# EAGLE design ADE9000_prototipo (EAGLE 9.4.2)
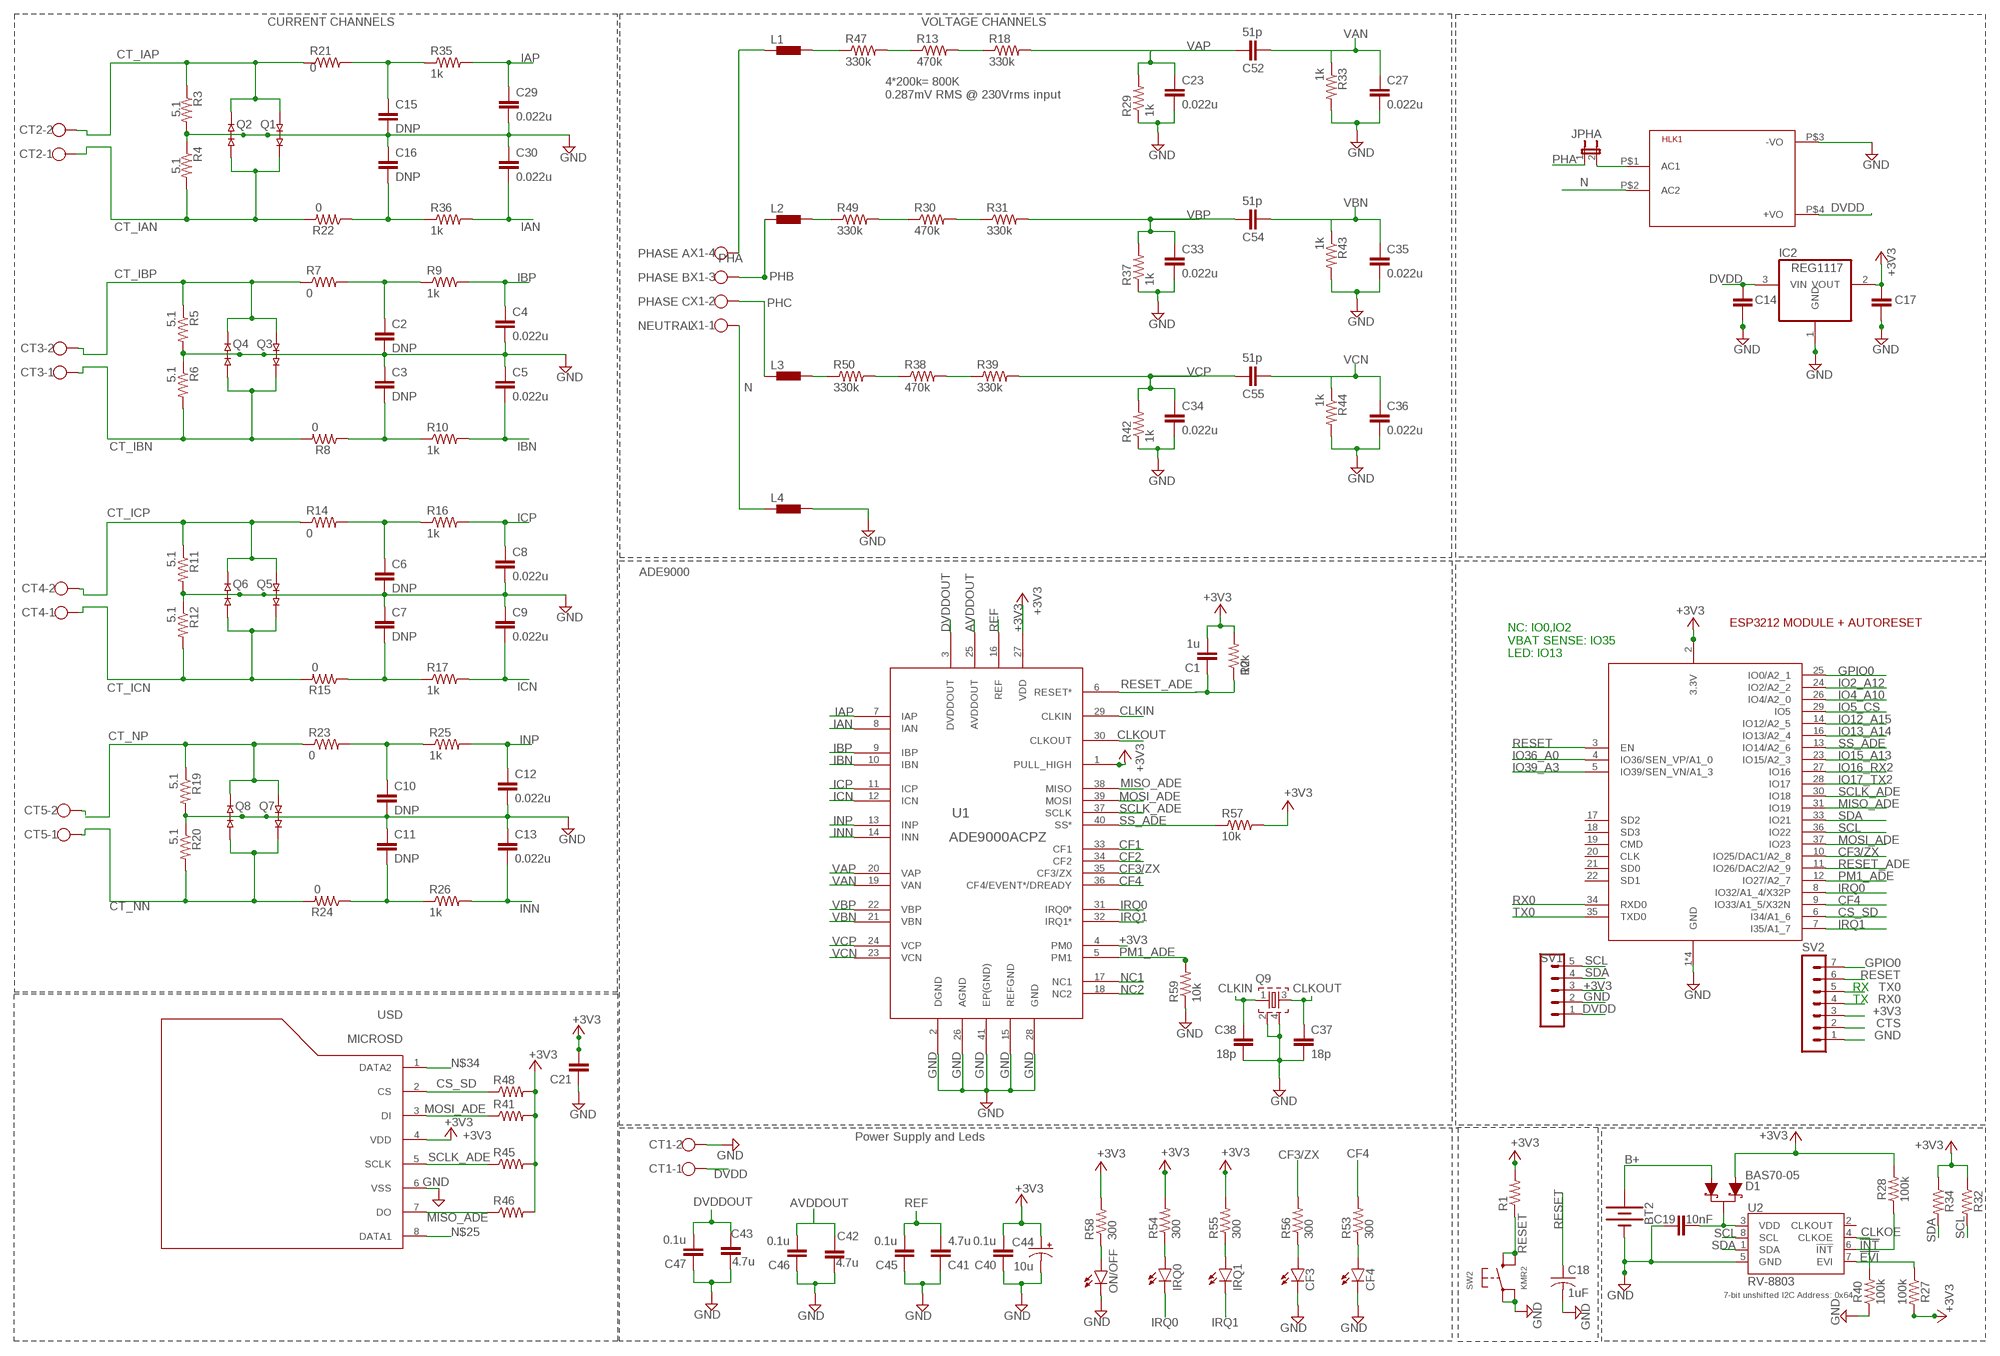
[diagram p0: schematic, sheet 1]

## Parts
BT2  BATTERY-12MM_SMD  [BATTCON_12MM]
C1  1u  C-EUC0805  [C0805]
C2  DNP  C-EUC0805  [C0805]
C3  DNP  C-EUC0805  [C0805]
C4  0.022u  C-EUC0805  [C0805]
C5  0.022u  C-EUC0805  [C0805]
C6  DNP  C-EUC0805  [C0805]
C7  DNP  C-EUC0805  [C0805]
C8  0.022u  C-EUC0805  [C0805]
C9  0.022u  C-EUC0805  [C0805]
C10  DNP  C-EUC0805  [C0805]
C11  DNP  C-EUC0805  [C0805]
C12  0.022u  C-EUC0805  [C0805]
C13  0.022u  C-EUC0805  [C0805]
C14  C-EUC1206  [C1206]
C15  DNP  C-EUC0805  [C0805]
C16  DNP  C-EUC0805  [C0805]
C17  C-EUC1206  [C1206]
C18  1uF  C-USC0805  [C0805]
C19  10nF  10NF-0603-50V-10%  [0603]
C21  0.1u  C-EUC0805  [C0805]
C23  0.022u  C-EUC0805  [C0805]
C27  0.022u  C-EUC0603  [C0603]
C29  0.022u  C-EUC0805  [C0805]
C30  0.022u  C-EUC0805  [C0805]
C33  0.022u  C-EUC0805  [C0805]
C34  0.022u  C-EUC0805  [C0805]
C35  0.022u  C-EUC0603  [C0603]
C36  0.022u  C-EUC0603  [C0603]
C37  18p  C-EUC0805  [C0805]
C38  18p  C-EUC0805  [C0805]
C40  0.1u  C-EUC0805  [C0805]
C41  4.7u  C-EUC0805  [C0805]
C42  4.7u  C-EUC0805  [C0805]
C43  4.7u  C-EUC0805  [C0805]
C44  10u  CPOL-USE1.8-4  [E1,8-4]
C45  0.1u  C-EUC0805  [C0805]
C46  0.1u  C-EUC0805  [C0805]
C47  0.1u  C-EUC0805  [C0805]
C52  51p  C-EUC0603  [C0603]
C54  51p  C-EUC0603  [C0603]
C55  51p  C-EUC0603  [C0603]
CF3  LEDCHIPLED_1206  [CHIPLED_1206]
CF4  LEDCHIPLED_1206  [CHIPLED_1206]
CT1  W237-102  [W237-102]
CT2  W237-102  [W237-102]
CT3  W237-102  [W237-102]
CT4  W237-102  [W237-102]
CT5  W237-102  [W237-102]
D1  BAS70-05  DIODE-SCHOTTKY-DUAL  [SOT23-3]
HLK1  HLK-PM013W  [HLK-PM01]
IC2  REG1117  [SOT223]
IRQ0  LEDCHIPLED_1206  [CHIPLED_1206]
IRQ1  LEDCHIPLED_1206  [CHIPLED_1206]
JPHA  JP1E  [JP1]
L1  1500  FERRITE_BEAD0805  [M0805]
L2  1500  FERRITE_BEAD0805  [M0805]
L3  1500  FERRITE_BEAD0805  [M0805]
L4  1500  FERRITE_BEAD0805  [M0805]
ON/OFF  LEDCHIPLED_1206  [CHIPLED_1206]
Q1  MMBD4148SE  DUAL_DIODE_SOT23-3  [SOT23-3]
Q2  MMBD4148SE  DUAL_DIODE_SOT23-3  [SOT23-3]
Q3  MMBD4148SE  DUAL_DIODE_SOT23-3  [SOT23-3]
Q4  MMBD4148SE  DUAL_DIODE_SOT23-3  [SOT23-3]
Q5  MMBD4148SE  DUAL_DIODE_SOT23-3  [SOT23-3]
Q6  MMBD4148SE  DUAL_DIODE_SOT23-3  [SOT23-3]
Q7  MMBD4148SE  DUAL_DIODE_SOT23-3  [SOT23-3]
Q8  MMBD4148SE  DUAL_DIODE_SOT23-3  [SOT23-3]
Q9  ECS-245.7-12-33Q-JES-TR  CRYSTAL_SMD128  [SMD_4PIN_3.2X2.1]
R1  R-US_R0805  [R0805]
R2  10k  R-US_R0805  [R0805]
R3  5.1  R-US_R0805  [R0805]
R4  5.1  R-US_R0805  [R0805]
R5  5.1  R-US_R0805  [R0805]
R6  5.1  R-US_R0805  [R0805]
R7  0  R-US_R0805  [R0805]
R8  0  R-US_R0805  [R0805]
R9  1k  R-US_R0805  [R0805]
R10  1k  R-US_R0805  [R0805]
R11  5.1  R-US_R0805  [R0805]
R12  5.1  R-US_R0805  [R0805]
R13  470k  R-US_R0805  [R0805]
R14  0  R-US_R0805  [R0805]
R15  0  R-US_R0805  [R0805]
R16  1k  R-US_R0805  [R0805]
R17  1k  R-US_R0805  [R0805]
R18  330k  R-US_R0805  [R0805]
R19  5.1  R-US_R0805  [R0805]
R20  5.1  R-US_R0805  [R0805]
R21  0  R-US_R0805  [R0805]
R22  0  R-US_R0805  [R0805]
R23  0  R-US_R0805  [R0805]
R24  0  R-US_R0805  [R0805]
R25  1k  R-US_R0805  [R0805]
R26  1k  R-US_R0805  [R0805]
R27  100k  100KOHM-0603-1/10W-1%  [0603]
R28  100k  100KOHM-0603-1/10W-1%  [0603]
R29  1k  R-US_R0805  [R0805]
R30  470k  R-US_R0805  [R0805]
R31  330k  R-US_R0805  [R0805]
R32  4.7k  4.7KOHM-0603-1/10W-1%  [0603]
R33  1k  R-US_R0603  [R0603]
R34  4.7KOHM-0603-1/10W-1%  [0603]
R35  1k  R-US_R0805  [R0805]
R36  1k  R-US_R0805  [R0805]
R37  1k  R-US_R0805  [R0805]
R38  470k  R-US_R0805  [R0805]
R39  330k  R-US_R0805  [R0805]
R40  100k  100KOHM-0603-1/10W-1%  [0603]
R41  R-US_R0805  [R0805]
R42  1k  R-US_R0805  [R0805]
R43  1k  R-US_R0603  [R0603]
R44  1k  R-US_R0603  [R0603]
R45  R-US_R0805  [R0805]
R46  R-US_R0805  [R0805]
R47  330k  R-US_R0805  [R0805]
R48  R-US_R0805  [R0805]
R49  330k  R-US_R0805  [R0805]
R50  330k  R-US_R0805  [R0805]
R53  300  R-US_R0805  [R0805]
R54  300  R-US_R0805  [R0805]
R55  300  R-US_R0805  [R0805]
R56  300  R-US_R0805  [R0805]
R57  10k  R-US_R0805  [R0805]
R58  300  R-US_R0805  [R0805]
R59  10k  R-US_R0805  [R0805]
SV1  MA05-1  [MA05-1]
SV2  MA07-1  [MA07-1]
SW2  KMR2  SWITCH_TACT_SMT4.6X2.8  [BTN_KMR2_4.6X2.8]
U1  ADE9000ACPZ  [CP_40_7]
U2  RV-8803  [RV-3028]
USD  MICROSD  [MICROSD]
X1  W237-4  [W237-4]
X4  ESP32_WROOM32_SKINNY  [WROOM32_SKINNY]

## Nets
!EVI: R27.1 U2.7(EVI)
!INT: R28.1 U2.6(!INT)
+3V3: C1.2 C17.1 C21.2 C40.2 C44.+ D1.1(A) IC2.2(VOUT) R1.2 R2.2 R27.2 R28.2 R32.1 R34.1 R41.2 R45.2 R46.2 R48.2 R54.2 R55.2 R57.2 R58.2 SV1.3 SV2.3 U1.1(PULL_HIGH) U1.4(PM0) U1.27(VDD) USD.4(VDD) X4.2(3.3V)
AVDDOUT: C42.1 C46.2 U1.25(AVDDOUT)
B+: BT2.PWR@1(+) D1.2(A1)
CF1: U1.33(CF1)
CF2: U1.34(CF2)
CF3/ZX: R56.2 U1.35(CF3/ZX) X4.10(IO25/DAC1/A2_8)
CF4: R53.2 U1.36(CF4/EVENT*/DREADY) X4.9(IO33/A1_5/X32N)
CLKIN: C38.1 Q9.1 U1.29(CLKIN)
CLKOE: R40.2 U2.4(CLKOE)
CLKOUT: C37.1 Q9.3 U1.30(CLKOUT)
CS_SD: R48.1 USD.2(CS) X4.6(I34/A1_6)
CT_IAN: CT2.1 Q1.2 Q2.1 R4.2 R22.2
CT_IAP: CT2.2 Q1.1 Q2.2 R3.1 R21.1
CT_IBN: CT3.1 Q3.2 Q4.1 R6.2 R8.2
CT_IBP: CT3.2 Q3.1 Q4.2 R5.1 R7.1
CT_ICN: CT4.1 Q5.2 Q6.1 R12.2 R15.2
CT_ICP: CT4.2 Q5.1 Q6.2 R11.1 R14.1
CT_NN: CT5.1 Q7.2 Q8.1 R20.2 R24.2
CT_NP: CT5.2 Q7.1 Q8.2 R19.1 R23.1
CTS: SV2.2
DVDD: C14.1 CT1.1 HLK1.P$4(+VO) IC2.3(VIN) SV1.1
DVDDOUT: C43.1 C47.2 U1.3(DVDDOUT)
GND: BT2.GND(-) C2.2 C3.1 C4.2 C5.1 C6.2 C7.1 C8.2 C9.1 C10.2 C11.1 C12.2 C13.1 C14.2 C15.2 C16.1 C17.2 C18.2 C19.1 C21.1 C23.2 C27.2 C29.2 C30.1 C33.2 C34.2 C35.2 C36.2 C37.2 C38.2 C40.1 C41.1 C42.2 C43.2 C44.- C45.1 C46.1 C47.1 CF3.C CF4.C CT1.2 HLK1.P$3(-VO) IC2.1(GND) L4.2 ON/OFF.C Q1.3 Q2.3 Q3.3 Q4.3 Q5.3 Q6.3 Q7.3 Q8.3 Q9.2 Q9.4 R3.2 R4.1 R5.2 R6.1 R11.2 R12.1 R19.2 R20.1 R29.1 R33.2 R37.1 R40.1 R42.1 R43.2 R44.2 R59.1 SV1.2 SV2.1 SW2.A'(P1) SW2.A(P) U1.2(DGND) U1.15(REFGND) U1.26(AGND) U1.28(GND) U1.41(EP(GND)) U2.5(GND) USD.6(VSS) X4.1(GND) X4.15(GND) X4.38(GND) X4.P$1(GND)
GPIO0: SV2.7 X4.25(IO0/A2_1)
IAN: C30.2 R36.2 U1.8(IAN)
IAP: C29.1 R35.2 U1.7(IAP)
IBN: C5.2 R10.2 U1.10(IBN)
IBP: C4.1 R9.2 U1.9(IBP)
ICN: C9.2 R17.2 U1.12(ICN)
ICP: C8.1 R16.2 U1.11(ICP)
INN: C13.2 R26.2 U1.14(INN)
INP: C12.1 R25.2 U1.13(INP)
IO2_A12: X4.24(IO2/A2_2)
IO4_A10: X4.26(IO4/A2_0)
IO5_CS: X4.29(IO5)
IO12_A15: X4.14(IO12/A2_5)
IO13_A14: X4.16(IO13/A2_4)
IO15_A13: X4.23(IO15/A2_3)
IO16_RX2: X4.27(IO16)
IO17_TX2: X4.28(IO17)
IO36_A0: X4.4(IO36/SEN_VP/A1_0)
IO39_A3: X4.5(IO39/SEN_VN/A1_3)
IRQ0: IRQ0.C U1.31(IRQ0*) X4.8(IO32/A1_4/X32P)
IRQ1: IRQ1.C U1.32(IRQ1*) X4.7(I35/A1_7)
MISO_ADE: R46.1 U1.38(MISO) USD.7(DO) X4.31(IO19)
MOSI_ADE: R41.1 U1.39(MOSI) USD.3(DI) X4.37(IO23)
N: HLK1.P$2(AC2) L4.1 X1.1
N$1: C19.2 D1.3(C) U2.3(VDD)
N$2: R13.1 R47.2
N$4: C3.2 R8.1 R10.1
N$5: C2.1 R7.2 R9.1
N$6: HLK1.P$1(AC1) JPHA.2
N$7: L3.2 R50.1
N$8: L2.2 R49.1
N$10: C7.2 R15.1 R17.1
N$11: C6.1 R14.2 R16.1
N$14: C16.2 R22.1 R36.1
N$17: C11.2 R24.1 R26.1
N$18: C10.1 R23.2 R25.1
N$20: CF3.A R56.1
N$21: ON/OFF.A R58.1
N$22: IRQ0.A R54.1
N$23: IRQ1.A R55.1
N$25: USD.8(DATA1)
N$29: CF4.A R53.1
N$32: R30.1 R49.2
N$33: R30.2 R31.1
N$34: USD.1(DATA2)
N$35: L1.2 R47.1
N$36: R13.2 R18.1
N$41: C15.1 R21.2 R35.1
N$45: R38.1 R50.2
N$46: R38.2 R39.1
NC1: U1.17(NC1)
NC2: U1.18(NC2)
PHA: JPHA.1 L1.1 X1.4
PHB: L2.1 X1.3
PHC: L3.1 X1.2
PM1_ADE: R59.2 U1.5(PM1) X4.12(IO27/A2_7)
REF: C41.2 C45.2 U1.16(REF)
RESET: C18.1 R1.1 SV2.6 SW2.B'(S1) SW2.B(S) X4.3(EN)
RESET_ADE: C1.1 R2.1 U1.6(RESET*) X4.11(IO26/DAC2/A2_9)
RX0: SV2.4 X4.34(RXD0)
SCL: R32.2 SV1.5 U2.8(SCL) X4.36(IO22)
SCLK_ADE: R45.1 U1.37(SCLK) USD.5(SCLK) X4.30(IO18)
SDA: R34.2 SV1.4 U2.1(SDA) X4.33(IO21)
SS_ADE: R57.1 U1.40(SS*) X4.13(IO14/A2_6)
TX0: SV2.5 X4.35(TXD0)
VAN: C27.1 C52.1 R33.1 U1.19(VAN)
VAP: C23.1 C52.2 R18.2 R29.2 U1.20(VAP)
VBN: C35.1 C54.1 R43.1 U1.21(VBN)
VBP: C33.1 C54.2 R31.2 R37.2 U1.22(VBP)
VCN: C36.1 C55.1 R44.1 U1.23(VCN)
VCP: C34.1 C55.2 R39.2 R42.2 U1.24(VCP)
Unconnected: U2.2(CLKOUT) X4.17(SD2) X4.18(SD3) X4.19(CMD) X4.20(CLK) X4.21(SD0) X4.22(SD1)

## Notes on the sheet
- CURRENT CHANNELS | VOLTAGE CHANNELS
- 4*200k= 800K
  0.287mV RMS @ 230Vrms input
- PHASE A
- PHASE B
- PHASE C
- NEUTRAL
- ADE9000
- ESP3212 MODULE + AUTORESET
- NC: IO0,IO2
  VBAT SENSE: IO35
  LED: IO13
- RX
- TX
- Power Supply and Leds
- 7-bit unshifted I2C Address: 0x64

## Library data of the parts
BT2 = SparkFun-Batteries:BATTERY: Battery - Single Cell A variety of battery chemistries, sizes, and footprints. Device List: 20MM_PTH - Coin Cell Battery Holder - 20mm (PTH) <https://www.sparkfun.com/products/783> 20MM_PTH_KIT- Coin Cell battery Holder - 20 mm (PTH) <http://www.sparkfun.com/products/783>kit version with special mask 6.8MM_PTH - Coin Cell Battery Holder - 6.8MM(SMD) <https://www.digikey.com/product-detail/en/seiko-instruments/MS621FE-FL11E/728-1057-ND/1889208?WT.srch=1&gclid=CNOQ5a6LzdQCFZS2wAodXCkE0g> 12MM_SMD - Coin Cell Battery Holder - 12mm (SMD) <https://www.sparkfun.com/products/10592> 12MM_PTH - Coin Cell Battery Holder - 12mm (PTH) <https://www.sparkfun.com/products/7948> 20MM_SMD - 20mm Coin Cell Battery Holder (SMD) (2 legs) Used on the Big Time Watch Kit <https://www.sparkfun.com/products/11734> 20MM_SMD_4LEGS - Coin Cell Battery Holder - 20mm (SMD) <https://www.sparkfun.com/products/11892> 20MM_SMD_4LEGS_OVERPASTE - Coin Cell Battery Holder - 20mm (SMD) <https://www.sparkfun.com/products/11892> (Over-paste on the legs) 24.5MM_PTH - Coin Cell Battery Holder - 24.5mm (PTH) <https://www.sparkfun.com/products/8863> 9V - 9V Battery Holder - PC Mount Used on the SparkFun SparkPunk Sound Kit <https://www.sparkfun.com/products/11177> and SparkFun SparkPunk Sequencer Kit <https://www.sparkfun.com/products/12707> 18650 - Battery Holder - 18650 (PTH) <https://www.sparkfun.com/products/13113> AA - Battery Holder - 1xAA (PTH) <https://www.sparkfun.com/products/7949> AAA - Battery Holder - 1xAAA (PTH) <https://www.sparkfun.com/products/12718> AA_KIT - Battery Holder - 1xAA (PTH) <https://www.sparkfun.com/products/7949> Special kit package - pads only have exposed copper on one side of the board. AAA_KIT - Battery Holder - 1xAAA (PTH) <https://www.sparkfun.com/products/12718> Special kit package - pads only have exposed copper on one side of the board.; PROD_ID: BATT-08044; SF_SKU: PRT-10592
C1-C17 C21 C23 C27 C29 C30 C33-C38 C40-C43 C45-C47 C52 C54 C55 = rcl:C-EU: CAPACITOR, European symbol; SPICEPREFIX: C
C18 = rcl:C-US: CAPACITOR, American symbol; SPICEPREFIX: C
C19 = SparkFun-Capacitors:10NF: 0.01uF/10nF/10,000pF ceramic capacitors A capacitor is a passive two-terminal electrical component used to store electrical energy temporarily in an electric field. CAP-09321; PROD_ID: CAP-00867
C44 = rcl:CPOL-US: POLARIZED CAPACITOR, American symbol; SPICEPREFIX: C
CF3 CF4 IRQ0 IRQ1 ON/OFF = led:LED: LED OSRAM: - CHIPLED LG R971, LG N971, LY N971, LG Q971, LY Q971, LO R971, LY R971 LH N974, LH R974 LS Q976, LO Q976, LY Q976 LO Q996 - Hyper CHIPLED LW Q18S LB Q993, LB Q99A, LB R99A - SideLED LS A670, LO A670, LY A670, LG A670, LP A670 LB A673, LV A673, LT A673, LW A673 LH A674 LY A675 LS A676, LA A676, LO A676, LY A676, LW A676 LS A679, LY A679, LG A679 - Hyper Micro SIDELED® LS Y876, LA Y876, LO Y876, LY Y876 LT Y87S - SmartLED LW L88C, LW L88S LB L89C, LB L89S, LG L890 LS L89K, LO L89K, LY L89K LS L896, LA L896, LO L896, LY L896 - TOPLED LS T670, LO T670, LY T670, LG T670, LP T670 LSG T670, LSP T670, LSY T670, LOP T670, LYG T670 LG T671, LOG T671, LSG T671 LB T673, LV T673, LT T673, LW T673 LH T674 LS T676, LA T676, LO T676, LY T676, LB T676, LH T676, LSB T676, LW T676 LB T67C, LV T67C, LT T67C, LS T67K, LO T67K, LY T67K, LW E67C LS E67B, LA E67B, LO E67B, LY E67B, LB E67C, LV E67C, LT E67C LW T67C LS T679, LY T679, LG T679 LS T770, LO T770, LY T770, LG T770, LP T770 LB T773, LV T773, LT T773, LW T773 LH T774 LS E675, LA E675, LY E675, LS T675 LS T776, LA T776, LO T776, LY T776, LB T776 LHGB T686 LT T68C, LB T68C - Hyper Mini TOPLED® LB M676 - Mini TOPLED Santana® LG M470 LS M47K, LO M47K, LY M47K Source: http://www.osram.convergy.de LUXEON: - LUMILED® LXK2-PW12-R00, LXK2-PW12-S00, LXK2-PW14-U00, LXK2-PW14-V00 LXK2-PM12-R00, LXK2-PM12-S00, LXK2-PM14-U00 LXK2-PE12-Q00, LXK2-PE12-R00, LXK2-PE12-S00, LXK2-PE14-T00, LXK2-PE14-U00 LXK2-PB12-K00, LXK2-PB12-L00, LXK2-PB12-M00, LXK2-PB14-N00, LXK2-PB14-P00, LXK2-PB14-Q00 LXK2-PR12-L00, LXK2-PR12-M00, LXK2-PR14-Q00, LXK2-PR14-R00 LXK2-PD12-Q00, LXK2-PD12-R00, LXK2-PD12-S00 LXK2-PH12-R00, LXK2-PH12-S00 LXK2-PL12-P00, LXK2-PL12-Q00, LXK2-PL12-R00 Source: www.luxeon.com KINGBRIGHT: KA-3528ASYC Source: www.kingbright.com
CT1-CT5 = con-wago-500:W237-102: WAGO SCREW CLAMP; MPN: 237-102; OC_FARNELL: unknown; OC_NEWARK: 70K9898
D1 = SparkFun-DiscreteSemi:DIODE-SCHOTTKY-DUAL: Diodes Incorporated - BAS70-05 Dual Schottky Diode Two Schottky Diodes in a single SOT-23 package. Low reverse current (100 nA) Vf: Datasheet referenced for footprint <https://www.diodes.com/assets/Datasheets/ds11007.pdf>; PROD_ID: DIO-14829
HLK1 = HLK-PM01:HLK-PM01: Hi-Link Power Supply HLK-PM01 3W Author: Ahmed Said <https://github.com/AhmedSaid/EAGLELibraries>
IC2 = burr-brown:REG1117: 800mA and 1A Low Dropout (LDO) Positive Regulator 1.8V, 2.5V, 2.85V, 3.3V, 5V, and Adj; MPN: REG1117; OC_FARNELL: 1097566; OC_NEWARK: 14P6981
JPHA = jumper:JP1E: JUMPER
L1-L4 = Inductors:FERRITE_BEAD; DIGIKEY: 490-1048-1-ND
Q1-Q8 = DIODE_LED:DUAL_DIODE; DIGIKEY: MMBD4148SECT-ND
Q9 = Crystals:CRYSTAL_SMD; DIGIKEY: XC2178CT-ND
R1 R2 R4 R6-R10 R12-R18 R20-R26 R29-R31 R33 R35-R39 R41-R50 R53-R59 = rcl:R-US_: RESISTOR, American symbol; SPICEPREFIX: R
R3 R5 R11 R19 = rcl:R-US_: RESISTOR, American symbol; DESCRIPTION: RES, 5.1, 0W1, 0%1, 0805-SMT, ROHS; MANUFACTURER: TE Connectivity Passive Product; MFR_PART_NO_#: CPF0805B5R1E1; SPICEPREFIX: R
R27 R28 R40 = SparkFun-Resistors:100KOHM: 100kΩ resistor A resistor is a passive two-terminal electrical component that implements electrical resistance as a circuit element. Resistors act to reduce current flow, and, at the same time, act to lower voltage levels within circuits. - Wikipedia; PROD_ID: RES-07828
R32 = SparkFun-Resistors:4.7KOHM: 4.7kΩ resistor A resistor is a passive two-terminal electrical component that implements electrical resistance as a circuit element. Resistors act to reduce current flow, and, at the same time, act to lower voltage levels within circuits. - Wikipedia; PROD_ID: RES-07857
R34 = SparkFun-Resistors:4.7KOHM: 4.7kΩ resistor A resistor is a passive two-terminal electrical component that implements electrical resistance as a circuit element. Resistors act to reduce current flow, and, at the same time, act to lower voltage levels within circuits. - Wikipedia; PROD_ID: RES-07857; VALUE: 4.7k
SV1 = con-lstb:MA05-1: PIN HEADER; OC_FARNELL: unknown; OC_NEWARK: unknown
SV2 = con-lstb:MA07-1: PIN HEADER; OC_FARNELL: unknown; OC_NEWARK: unknown
SW2 = microbuilder:SWITCH_TACT_SMT: SMT Tact Switches 6x6mm - Digikey: P12940SCT-ND KMR2 (4.6x2.8mm) - Digikey: 401-1426-1-ND EVQ-PQHB55 - Light Touch, 160GF (4.5x4.5mm) - Digikey: P8090SCT-ND KMT0 - KMT021 NGJ LHS (etc.) IP68/Waterproof - Digikey: CKN10289CT-ND
U1 = IC:ADE9000ACPZ; DIGIKEY: ADE9000ACPZ-RLCT-ND
U2 = SparkFun-Clocks:RV-8803: Micro Crystal RV-8803 - Temperature compensated RTC Ultra accurate plus/minus 3PPM I2C RTC. Temperature compensated crystal for low drift; PROD_ID: IC-14828
USD = Seeed:MICROSD
X1 = con-wago-500:W237-4: WAGO SCREW CLAMP; OC_FARNELL: unknown; OC_NEWARK: unknown
X4 = microbuilder:ESP32_WROOM32

## Board
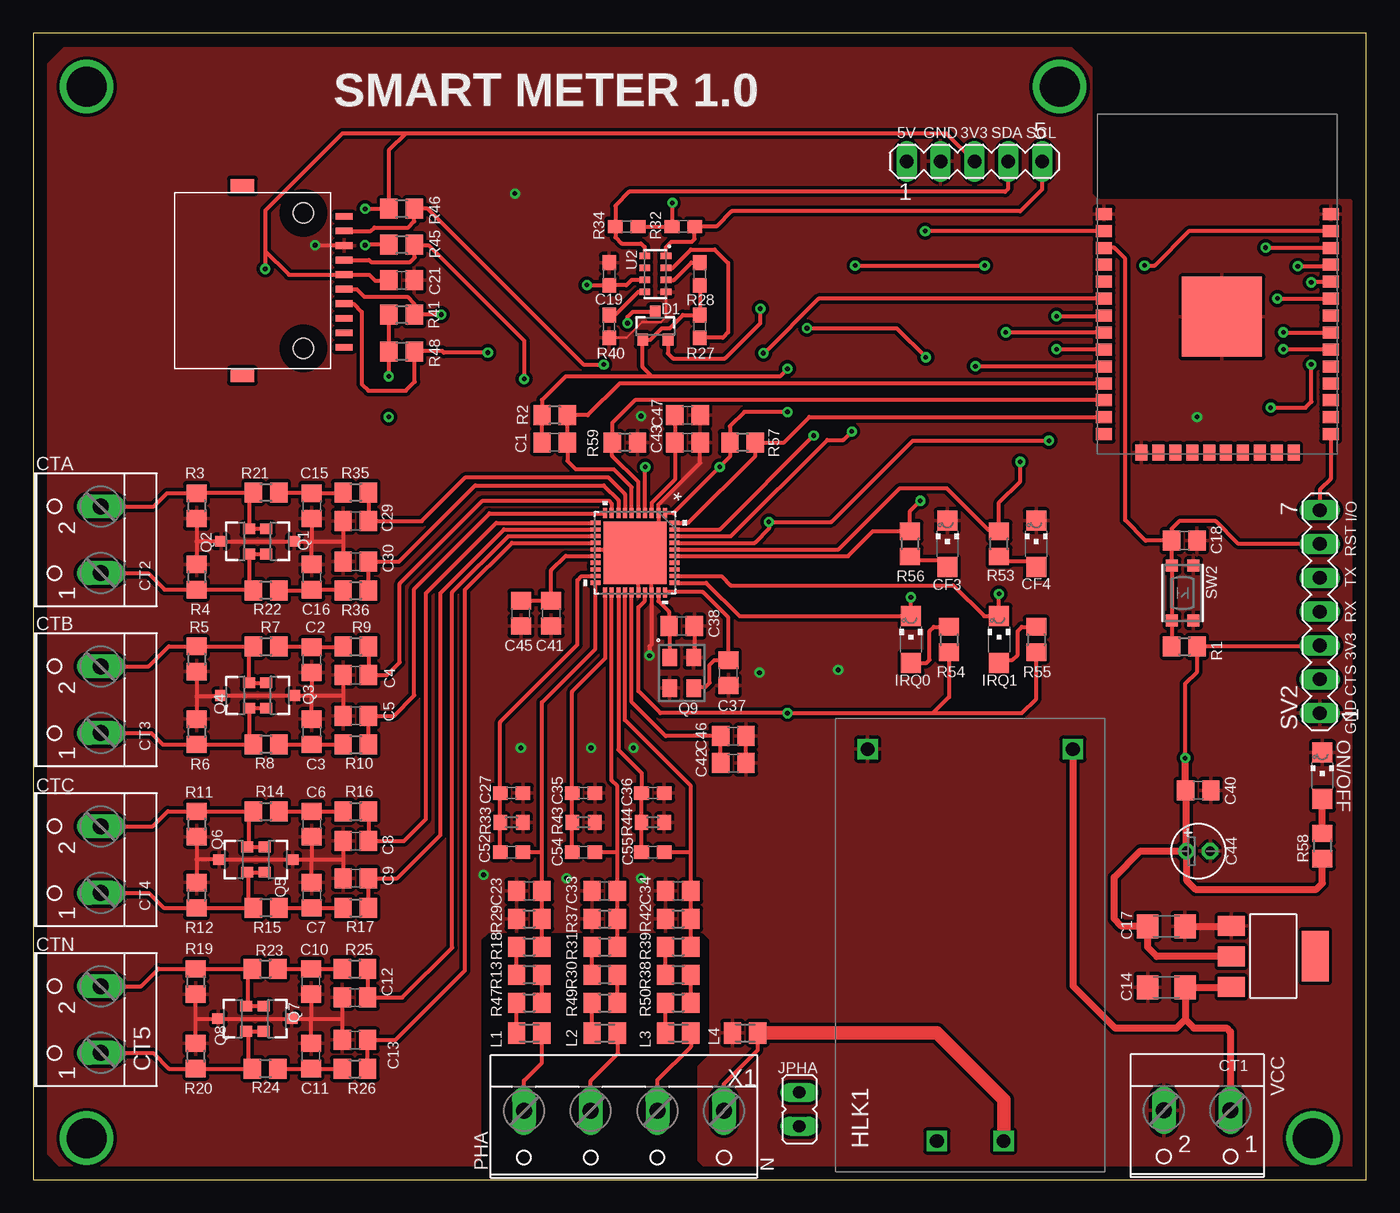
[diagram p1: board, top side]
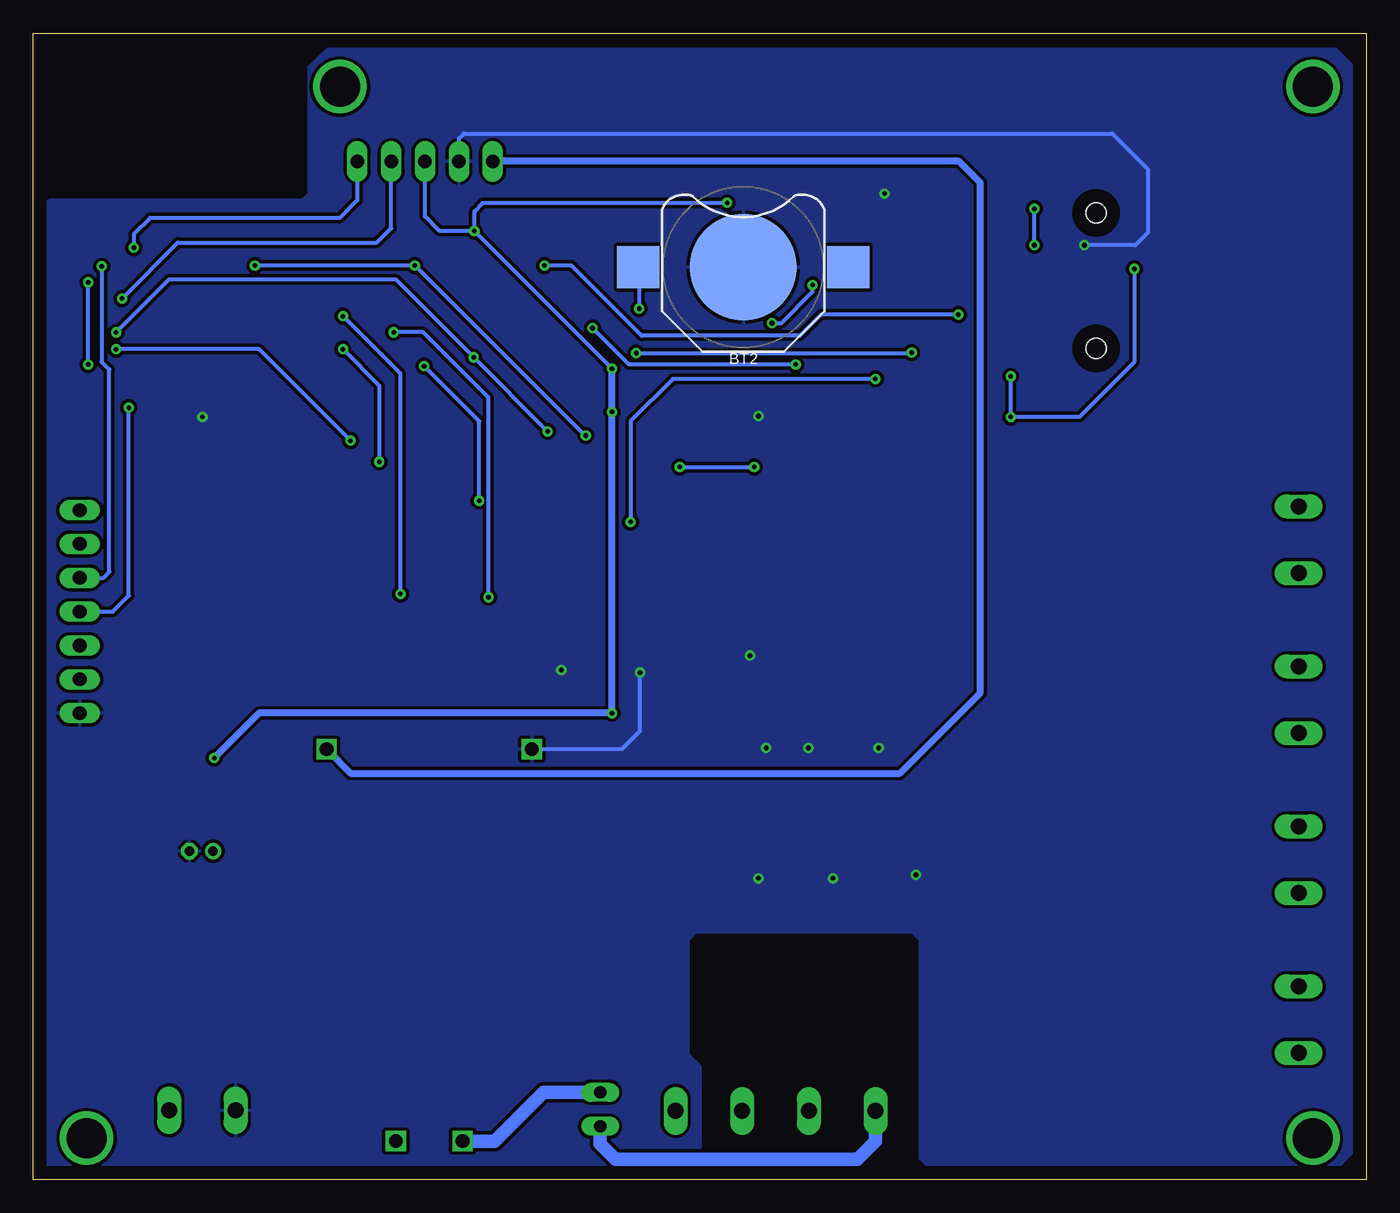
[diagram p2: board, bottom side, seen from below]

Size 100 x 86 mm. Coordinates in mm from the lower left corner, seen from the top.
Outline: 0,0 100,0 100,86 0,86 0,0
Copper layers (1*16): Top 0.035mm / dielectric 1.5mm / Bottom 0.035mm
Design rules "default": minimum track width 6mil, minimum drill 0.35mm, track to track 6mil, track to pad 6mil, pad to pad 6mil, via to via 6mil, smd to smd 6mil, copper to edge 40mil, drill to drill 6mil, minimum pad ring 10mil, minimum via ring 8mil, stop-mask expansion 4mil, vias tented up to drill 0mil, thermal gap 10mil

### Footprints (pad centres in the part's own frame; a part is rotated, then mirrored left to right if it is on the bottom)
BATTCON_12MM = smd 8 x 8: GND 0,0 | smd 3.175 x 3.175: PWR@1 -7.874,0; PWR@2 7.874,0
C0805 = smd 1.3 x 1.5: 1 -0.95,0; 2 0.95,0
C1206 = smd 1.6 x 1.8: 1 -1.4,0; 2 1.4,0
0603 = smd 1.1 x 1: 1 -0.85,0; 2 0.85,0
C0603 = smd 1.1 x 1: 1 -0.85,0; 2 0.85,0
E1,8-4 = drill 0.711 pad 1.168: + -0.889,0 | drill 0.711 pad 1.168 octagon: - 0.889,0
CHIPLED_1206 = smd 1.5 x 1.5: A 0,-1.75; C 0,1.75
W237-102 = drill 1.194 long: 1 -2.5,-1.27; 2 2.5,-1.27
SOT23-3 = smd 0.8 x 0.9: 1 -0.95,-1; 2 0.95,-1; 3 0,1.1
HLK-PM01 = drill 1.016 square: P$1 -14.7,2.5; P$2 -14.7,-2.5; P$3 14.7,7.7; P$4 14.7,-7.7
SOT223 = smd 1.499 x 2.007: 1 -2.261,-3.15; 2 0.025,-3.15; 3 2.311,-3.15 | smd 3.81 x 2.007: 4 0,3.15
JP1 = drill 0.914 long: 1 0,-1.27; 2 0,1.27
M0805 = smd 1.3 x 1.6: 1 -0.95,0; 2 0.95,0
SMD_4PIN_3.2X2.1 = smd 1.3 x 1.1: 1 -1.15,-0.9; 2 1.15,-0.9; 3 1.15,0.9; 4 -1.15,0.9
R0805 = smd 1.3 x 1.5: 1 -0.95,0; 2 0.95,0
R0603 = smd 1 x 1.1: 1 -0.85,0; 2 0.85,0
MA05-1 = drill 1.016 long: 1 -5.08,0; 2 -2.54,0; 3 0,0; 4 2.54,0; 5 5.08,0
MA07-1 = drill 1.016 long: 1 -7.62,0; 2 -5.08,0; 3 -2.54,0; 4 0,0; 5 2.54,0; 6 5.08,0; 7 7.62,0
BTN_KMR2_4.6X2.8 = smd 0.9 x 0.9: A 2.05,0.8; A' -2.05,0.8; B 2.05,-0.8; B' -2.05,-0.8
CP_40_7 = smd 0.762 x 0.305: 1 -2.972,2.25; 2 -2.972,1.75; 3 -2.972,1.25; 4 -2.972,0.75; 5 -2.972,0.25; 6 -2.972,-0.25; 7 -2.972,-0.75; 8 -2.972,-1.25; 9 -2.972,-1.75; 10 -2.972,-2.25; 21 2.972,-2.25; 22 2.972,-1.75; 23 2.972,-1.25; 24 2.972,-0.75; 25 2.972,-0.25; 26 2.972,0.25; 27 2.972,0.75; 28 2.972,1.25; 29 2.972,1.75; 30 2.972,2.25 | smd 0.305 x 0.762: 11 -2.25,-2.972; 12 -1.75,-2.972; 13 -1.25,-2.972; 14 -0.75,-2.972; 15 -0.25,-2.972; 16 0.25,-2.972; 17 0.75,-2.972; 18 1.25,-2.972; 19 1.75,-2.972; 20 2.25,-2.972; 31 2.25,2.972; 32 1.75,2.972; 33 1.25,2.972; 34 0.75,2.972; 35 0.25,2.972; 36 -0.25,2.972; 37 -0.75,2.972; 38 -1.25,2.972; 39 -1.75,2.972; 40 -2.25,2.972 | smd 4.699 x 4.699: 41 0,0
RV-3028 = smd 0.5 x 0.8: 1 -1.35,-0.8; 2 -0.45,-0.8; 3 0.45,-0.8; 4 1.35,-0.8; 5 1.35,0.8; 6 0.45,0.8; 7 -0.45,0.8; 8 -1.35,0.8
MICROSD = smd 1.27 x 0.508: 1 0,-7.645; 2 0,-6.553; 3 0,-5.461; 4 0,-4.369; 5 0,-3.277; 6 0,-2.184; 7 0,-1.092; 8 0,0; 9 0,-8.738; 10 0,-9.83 | smd 1.778 x 1.016: RSV1 -7.62,2.286; RSV2 -7.62,-11.938 | hole 1.524: -3.048,-9.906; -3.048,0.254
W237-4 = drill 1.194 long: 1 -7.5,-1.27; 2 -2.5,-1.27; 3 2.5,-1.27; 4 7.5,-1.27
WROOM32_SKINNY = smd 1.2 x 0.9: 1 -8.5,5; 2 -8.5,3.73; 3 -8.5,2.46; 4 -8.5,1.19; 5 -8.5,-0.08; 6 -8.5,-1.35; 7 -8.5,-2.62; 8 -8.5,-3.89; 9 -8.5,-5.16; 10 -8.5,-6.43; 11 -8.5,-7.7; 12 -8.5,-8.97; 13 -8.5,-10.24; 14 -8.5,-11.51; 25 8.5,-11.51; 26 8.5,-10.24; 27 8.5,-8.97; 28 8.5,-7.7; 29 8.5,-6.43; 30 8.5,-5.16; 31 8.5,-3.89; 32 8.5,-2.62; 33 8.5,-1.35; 34 8.5,-0.08; 35 8.5,1.19; 36 8.5,2.46; 37 8.5,3.73; 38 8.5,5 | smd 0.9 x 1.2: 15 -5.7,-12.9; 16 -4.43,-12.9; 17 -3.16,-12.9; 18 -1.89,-12.9; 19 -0.62,-12.9; 20 0.65,-12.9; 21 1.92,-12.9; 22 3.19,-12.9; 23 4.46,-12.9; 24 5.73,-12.9 | smd 6 x 6: P$1 0.34,-2.7

### Placement (x,y rotation side)
BT2  46.74,68.45 0 bottom
C1  39.12,55.31 180 top
C2  20.89,38.99 270 top
C3  20.89,33.59 270 top
C4  24.19,37.85 180 top
C5  24.19,34.8 0 top
C6  20.89,26.67 270 top
C7  20.89,21.34 270 top
C8  24.19,25.4 180 top
C9  24.19,22.61 0 top
C10  20.83,14.86 270 top
C11  20.83,9.27 270 top
C12  24.13,13.65 180 top
C13  24.13,10.48 0 top
C14  85,14.44 180 top
C15  20.89,50.55 270 top
C16  20.89,45.21 270 top
C17  85,19 0 top
C18  86.36,47.94 0 top
C19  43.2,67.94 270 top
C21  27.64,67.48 180 top
C23  37.21,21.65 180 top
C27  35.88,29 0 top
C29  24.19,49.4 180 top
C30  24.19,46.35 0 top
C33  42.86,21.65 180 top
C34  48.39,21.65 180 top
C35  41.27,29 0 top
C36  46.48,29 0 top
C37  52.14,38.02 270 top
C38  48.64,41.53 0 top
C40  87.4,29.21 180 top
C41  38.86,42.48 90 top
C42  52.51,31.24 0 top
C43  49.09,55.31 0 top
C44  87.4,24.64 0 top
C45  36.58,42.48 90 top
C46  52.51,33.27 180 top
C47  49.09,57.34 180 top
C52  35.88,24.56 0 top
C54  41.27,24.56 0 top
C55  46.48,24.56 0 top
CF3  68.58,47.69 0 top
CF4  75.25,47.69 0 top
CT1  87.32,3.93 180 top
CT2  3.8,48 90 top
CT3  3.8,36 90 top
CT4  3.8,24 90 top
CT5  3.8,12 90 top
D1  46.67,64.01 0 top
HLK1  70.29,17.59 90 top
IC2  93.03,16.76 270 top
IRQ0  65.85,40.51 0 top
IRQ1  72.45,40.51 0 top
JPHA  57.47,5.27 0 top
L1  37.21,11 180 top
L2  42.86,11 180 top
L3  48.39,11 180 top
L4  53.4,11 180 top
ON/OFF  96.71,30.29 0 top
Q1  18.48,47.88 270 top
Q2  15.18,47.88 90 top
Q3  18.48,36.32 270 top
Q4  15.18,36.32 90 top
Q5  18.35,24 270 top
Q6  15.05,24 90 top
Q7  18.29,12.06 270 top
Q8  14.99,12.06 90 top
Q9  48.64,38.02 270 top
R1  86.36,40.01 0 top
R2  39.12,57.34 180 top
R3  12.26,50.55 270 top
R4  12.26,45.21 270 top
R5  12.26,39.05 270 top
R6  12.26,33.59 270 top
R7  17.46,40.01 0 top
R8  17.46,32.64 180 top
R9  24.19,40.01 0 top
R10  24.19,32.64 0 top
R11  12.26,26.67 270 top
R12  12.26,21.34 270 top
R13  37.21,15.37 180 top
R14  17.46,27.62 0 top
R15  17.46,20.38 180 top
R16  24.19,27.62 0 top
R17  24.19,20.38 0 top
R18  37.21,17.46 0 top
R19  12.19,14.86 270 top
R20  12.19,9.27 270 top
R21  17.46,51.56 0 top
R22  17.46,44.2 180 top
R23  17.4,15.81 0 top
R24  17.4,8.32 180 top
R25  24.13,15.81 0 top
R26  24.13,8.32 0 top
R27  50,64.01 90 top
R28  50,67.94 270 top
R29  37.21,19.56 0 top
R30  42.86,15.37 180 top
R31  42.86,17.46 0 top
R32  48.77,71.5 0 top
R33  35.88,26.8 0 top
R34  44.51,71.5 180 top
R35  24.19,51.56 0 top
R36  24.19,44.2 0 top
R37  42.86,19.56 0 top
R38  48.39,15.37 180 top
R39  48.39,17.46 0 top
R40  43.2,64.01 90 top
R41  27.64,64.88 180 top
R42  48.39,19.56 0 top
R43  41.27,26.8 0 top
R44  46.48,26.8 0 top
R45  27.64,70.13 180 top
R46  27.64,72.83 180 top
R47  37.21,13.27 0 top
R48  27.64,62.13 180 top
R49  42.86,13.27 0 top
R50  48.39,13.27 0 top
R53  72.45,47.69 90 top
R54  68.71,40.51 270 top
R55  75.25,40.51 270 top
R56  65.79,47.69 90 top
R57  53.21,55.31 180 top
R58  96.71,25.02 270 top
R59  44.39,55.31 180 top
SV1  70.61,76.39 0 top
SV2  96.52,42.61 90 top
SW2  86.23,44.01 270 top
U1  45.14,47.02 270 top
U2  46.67,67.94 270 top
USD  23.3,72.26 0 top
X1  44.32,3.87 180 top
X4  88.84,67.44 0 top

### Tracks (layer width: path | path; a pad name or v marks a point on that pad's centre or on a via)
!EVI
  Top 0.305: U2.7 47.95,68.39 49.34,69.79 51.12,69.79 52.13,68.77 52.13,63.56 51.73,63.16 R27.1
!INT
  Top 0.305: U2.6 48.06,67.5 49.36,68.8 R28.1
+3V3  (via drill 0.35)
  Top 0.254: 26.67,72.84 R46.2
  Top 0.305: C1.2 R2.2 38.16,58.48 39.94,60.26 46.42,60.26 | v56.58,60.83 56.01,60.26 46.42,60.26 | X4.2 v66.91,71.17 | v56.58,57.59 53.34,57.59 52.26,56.52 R57.2 52.26,54.23 v51.5,53.47 48.03,50 U1.1 | U1.4 45.89,53.45 v45.91,53.47 | 67.5,34.99 v56.58,34.99 47.05,34.99 45.4,36.64 45.4,42.93 45.89,43.42 U1.27 | R54.2 68.71,36.2 67.5,34.99 | 67.5,34.99 74.17,34.99 75.25,36.07 R55.2 | v86.42,31.62 86.42,37.21 87.31,38.1 R1.2 96.46,40.01 SV2.3 | R28.2 R27.2 48.73,64.86 47.75,63.88 47.16,63.88 46.29,63.01 D1.1 45.72,60.96 46.42,60.26 | R34.1 R32.1 47.94,71.53 v47.94,73.28 | C21.2 26.64,67.44 25.65,67.44 25.21,67.88 23.32,67.88 USD.4 19.18,67.88 17.4,69.66 | SV1.3 68.52,78.49 27.94,78.49 | 27.94,78.49 26.67,77.22 26.67,72.84 | 27.94,78.49 23.18,78.49 17.4,72.71 17.4,69.66 | R41.2 R48.2 26.68,60.28 v26.67,60.26 | R45.2 25.11,70.13 25.08,70.1 v24.89,70.1 | v24.89,72.83 26.68,72.83 R46.2 | 17.4,69.66 v17.4,68.33
  Top 0.508: IC2.2 84.29,16.74 83.6,17.43 C17.1 81.64,19 81.09,19.56 81.09,22.67 83.06,24.64 C44.+ | C44.+ 86.51,29.15 C40.2 86.45,31.6 v86.42,31.62 | C44.+ 86.51,22.46 87.19,21.78 96.27,21.78 96.71,22.23 R58.2
  Bottom 0.305: v56.58,60.83 v66.91,71.17 | v51.5,53.47 v45.91,53.47 | v66.91,71.17 69.52,71.17 70.61,72.26 SV1.3 | v66.91,71.17 66.91,72.63 66.26,73.28 v47.94,73.28 | v26.67,60.26 v26.67,57.21 21.53,57.21 17.4,61.34 v17.4,68.33 | v24.89,70.1 v24.89,72.83
  Bottom 0.508: v86.42,31.62 83.06,34.99 v56.58,34.99 v56.58,57.59 v56.58,60.83
AVDDOUT
  Top 0.305: C42.1 C46.2 47.43,33.27 44.89,35.81 U1.25
B+  (via drill 0.35)
  Top 0.305: D1.2 47.62,61.98 48.01,61.59 51.88,61.59 54.55,64.26 v54.55,65.34
  Bottom 0.305: BT2.PWR@1 54.55,68.39 v54.55,65.34
CF3/ZX  (via drill 0.35)
  Top 0.305: U1.35 61.13,46.77 62.99,48.64 R56.2 65.79,50.16 v66.55,50.93 | v70.67,61.02 80.32,61.02 X4.10
  Bottom 0.305: v66.55,50.93 66.55,56.9 v70.67,61.02
CF4  (via drill 0.35)
  Top 0.305: U1.36 60.42,47.27 65.02,51.88 68.52,51.88 71.63,48.77 72.45,48.77 R53.2 72.45,50.8 74.04,52.39 v74.04,53.85 | v76.77,62.29 80.32,62.29 X4.9
  Bottom 0.305: v74.04,53.85 74.04,59.56 v76.77,62.29
CLKIN
  Top 0.305: Q9.1 47.74,41.48 C38.1 47.69,42.6 46.89,43.4 U1.29
CLKOE
  Top 0.305: U2.4 45.39,66.59 43.65,64.86 R40.2
CLKOUT
  Top 0.305: Q9.3 49.63,36.96 50.42,36.96 50.74,37.27 50.74,38.61 51.1,38.98 C37.1 52.14,42.15 50.23,44.07 47.41,44.07 U1.30
CS_SD  (via drill 0.35)
  Top 0.305: X4.6 58.91,66.09 54.8,61.98 v54.77,62.01 | 28.62,62.17 R48.1 | USD.2 24.02,65.71 24.64,65.09 24.64,59.69 25.15,59.18 27.94,59.18 28.62,59.87 28.62,62.17 | v34.1,62.04 30.8,62.04 30.67,62.17 28.62,62.17
  Bottom 0.305: v54.77,62.01 34.13,62.01 v34.1,62.04
CT_IAN
  Top 0.305: Q1.2 Q2.1 16.18,44.53 R22.2 16.45,44.26 R4.2 9.84,44.26 8.6,45.5 CT2.1
CT_IAP
  Top 0.305: CT2.2 9.03,50.5 10.03,51.5 R3.1 12.32,51.56 R21.1 16.18,51.23 Q2.2 Q1.1
CT_IBN
  Top 0.305: Q3.2 Q4.1 16.18,32.98 R8.2 R6.2 9.72,32.64 8.85,33.5 CT3.1
CT_IBP
  Top 0.305: CT3.2 8.65,38.5 10.16,40.01 R5.1 16.19,40 | 16.19,40 R7.1 | 16.19,40 16.18,39.99 Q4.2 Q3.1
CT_ICN
  Top 0.305: Q5.2 Q6.1 16.13,22.97 16.13,20.77 R15.2 R12.2 9.78,20.38 8.66,21.5 CT4.1
CT_ICP
  Top 0.305: CT4.2 8.97,26.5 10.1,27.62 R11.1 16.19,27.62 | 16.19,27.62 R14.1 | 16.19,27.62 16.19,25.1 Q6.2 Q5.1
CT_NN
  Top 0.305: 16.13,8.32 R20.2 10.16,8.32 8.98,9.5 CT5.1 | 16.13,8.32 R24.2 | 16.13,8.32 16.13,10.97 Q8.1 Q7.2
CT_NP
  Top 0.305: CT5.2 8.09,14.5 9.4,15.81 R19.1 16.13,15.81 | 16.13,15.81 R23.1 | 16.13,15.81 16.13,13.16 Q8.2 Q7.1
DVDD
  Top 0.406: 89.86,14.44 IC2.3
  Top 0.508: 89.86,14.44 C14.1 86.42,14.41 86.42,12 | HLK1.P$4 78,14.53 81.15,11.37 85.79,11.37 86.42,12 | 86.42,12 87.06,11.37 89.53,11.37 89.82,11.08 CT1.1
  Bottom 0.508: HLK1.P$4 76.19,30.48 34.99,30.48 28.96,36.51 28.96,74.8 29.15,74.99 29.43,75.28 30.54,76.39 SV1.1
DVDDOUT
  Top 0.305: C47.2 C43.1 48.14,52.52 46.39,50.77 U1.3
GND  (via drill 0.35)
  Top 0.203: R40.1 44.49,63.16 45.67,64.34 47.11,64.34 47.47,64.7 U2.5 | 45.24,47.09 45.15,46.99
  Top 0.305: R3.2 12.26,47.88 | 12.26,47.88 R4.1 | 12.26,47.88 Q2.3 Q1.3 20.89,47.88 | C15.2 20.89,47.88 | C16.1 20.89,47.88 | C29.2 23.24,47.88 | 23.24,47.88 C30.1 | 20.89,47.88 23.24,47.88 | R5.2 12.26,36.26 | 12.26,36.26 R6.1 | 12.26,36.26 14.01,36.26 Q4.3 Q3.3 20.89,36.32 | C2.2 20.89,36.32 | C3.1 20.89,36.32 | C4.2 23.24,36.32 | 23.24,36.32 C5.1 | 20.89,36.32 23.24,36.32 | R11.2 12.26,24 | 12.26,24 R12.1 | 12.26,24 Q6.3 Q5.3 20.89,24 | C6.2 20.89,24 | C7.1 20.89,24 | C8.2 23.24,24 | 23.24,24 C9.1 | 20.89,24 23.24,24 | R20.1 12.19,12 | 12.19,12 R19.2 | 12.19,12 13.82,12 Q8.3 Q7.3 20.77,12.06 20.83,12 | C10.2 20.83,12 | C11.1 20.83,12 | C12.2 23.18,12.06 | 23.18,12.06 C13.1 | 20.83,12 20.89,12.06 23.18,12.06 | C42.2 C46.1 | C38.2 49.59,39.23 Q9.4 | v21.14,70.1 23.28,70.1 USD.6 | 45.16,47.04 U1.41 | 45.39,46.74 45.15,46.99 44.86,47.27 U1.15 | C43.2 50.03,53.77 46.89,50.63 U1.2 46.89,48.73 45.24,47.09 45.39,46.94 | U1.26 45.39,46.94 | 45.39,46.94 46.39,45.94 U1.28 46.39,40.17 46.23,40.01 v46.23,39.31
  Top 0.508: C17.2 89.86,19 IC2.1
  Bottom 0.305: SV1.2 68.07,78.11 67.69,78.49 19.05,78.49 16.38,75.82 16.38,71.06 17.34,70.1 v21.14,70.1 | HLK1.P$3 55.85,32.29 54.48,33.66 v54.48,38.04
  other vias: 60.39,38.23 87.31,57.21 36.13,73.98 45.59,57.28 45.59,22.61 33.78,22.86 40.01,22.61 36.58,32.38 41.85,32.38 45.02,32.38
  pour Top (isolate 0.254): 2.92,0.06 0.13,2.86 0.13,3.05 0.13,82.74 2.6,85.22 77.6,85.22 78.8,84.01 79.38,83.44 79.38,74.49 79.38,73.98 79.82,73.53 81.15,73.53 98.81,73.53 99.95,72.39 99.95,2.03 97.98,0.06 51.24,0.06 49.91,1.4 49.91,8.51 50.8,9.4 50.8,17.97 50.23,18.54 34.1,18.54 34.04,18.48 33.53,17.97 33.53,16.89 33.53,1.59 32,0.06
  pour Bottom (isolate 0.254): 2.92,0.06 0.13,2.86 0.13,3.05 0.13,82.74 2.6,85.22 77.6,85.22 78.8,84.01 79.38,83.44 79.38,74.49 79.38,73.98 79.82,73.53 81.15,73.53 98.81,73.53 99.95,72.39 99.95,2.03 97.98,0.06 51.24,0.06 49.91,1.4 49.91,8.51 50.8,9.4 50.8,17.97 50.23,18.54 34.1,18.54 34.04,18.48 33.53,17.97 33.53,16.89 33.53,1.59 32,0.06
GPIO0
  Top 0.305: X4.25 97.34,52.57 96.52,51.75 SV2.7
IAN
  Top 0.305: R36.2 C30.2 27.43,46.35 33.15,52.07 42.8,52.07 43.89,50.98 U1.8
IAP
  Top 0.305: R35.2 C29.1 29.15,49.4 32.45,52.7 43.12,52.7 44.39,51.43 U1.7
IBN
  Top 0.305: R10.2 C5.2 27.05,34.8 28.57,36.32 28.57,44.32 34.23,49.97 42.87,49.97 U1.10
IBP
  Top 0.305: R9.2 C4.1 26.54,37.85 27.5,38.8 27.5,44.7 33.72,50.93 43.18,50.93 43.39,50.71 U1.9
ICN
  Top 0.305: R17.2 C9.2 27.3,22.61 30.54,25.84 30.54,44.01 35.31,48.77 U1.12
ICP
  Top 0.305: R16.2 C8.1 27.81,25.4 29.46,27.05 29.46,44.01 34.73,49.27 U1.11
INN
  Top 0.305: R26.2 C13.2 27.18,10.48 32.38,15.68 32.38,44.26 35.9,47.77 U1.14
INP
  Top 0.305: R25.2 C12.1 27.69,13.65 31.43,17.4 31.43,44.07 35.64,48.27 U1.13
IRQ0  (via drill 0.35)
  Top 0.305: U1.31 50.48,44.77 52.99,42.26 IRQ0.C v65.85,43.69 | v72.96,63.56 80.32,63.56 X4.8
  Bottom 0.305: v65.85,43.69 65.85,58.67 70.74,63.56 v72.96,63.56
IRQ1  (via drill 0.35)
  Top 0.305: U1.32 51.63,45.27 52.32,44.58 69.03,44.58 71.34,42.26 IRQ1.C v72.45,43.94 | v76.77,64.77 80.29,64.77 X4.7
  Bottom 0.305: v72.45,43.94 72.45,60.45 v76.77,64.77
MISO_ADE  (via drill 0.35)
  Top 0.305: U1.38 52.34,48.27 59.56,55.5 60.77,55.5 v61.4,56.13 | v93.79,63.56 93.81,63.55 X4.31 | v42.8,61.15 41.27,61.15 29.6,72.83 R46.1 28.59,71.89 28.13,71.44 25.59,71.44 25.32,71.17 USD.7 | v58.04,63.88 64.77,63.88 v66.96,61.69
  Bottom 0.305: v61.4,56.13 v66.96,61.69 72.77,67.5 89.85,67.5 v93.79,63.56 | v42.8,61.15 55.31,61.15 v58.04,63.88
MOSI_ADE  (via drill 0.35)
  Top 0.305: U1.39 51.51,48.77 v58.55,55.82 | v83.38,68.58 84.14,68.58 86.74,71.18 97.32,71.18 X4.37 | v61.66,68.58 v71.37,68.58 | USD.3 24.26,66.8 24.83,66.23 28.07,66.23 28.59,65.71 R41.1 28.61,64.9 v30.61,64.9
  Bottom 0.305: v58.55,55.82 58.61,55.82 v71.37,68.58 v83.38,68.58 | v30.61,64.9 40.89,64.9 42.48,63.31 54.36,63.31 59.63,68.58 v61.66,68.58
N
  Top 0.305: L4.1 54.36,9.72 51.82,7.18 X1.1
  Top 1.016: L4.1 67.8,11 72.83,5.97 72.83,2.93 HLK1.P$2
N1  (via drill 3)
  other vias: 4,3.1
N2  (via drill 3)
  other vias: 96,3.1
N3  (via drill 3)
  other vias: 4,82
N4  (via drill 3)
  other vias: 77,82
N$1  (via drill 0.35)
  Top 0.305: U2.3 44.89,67.5 44.49,67.09 C19.2 43.17,67.12 v41.53,67.12 | v44.58,64.26 44.58,64.71 44.98,65.11 D1.3
  Bottom 0.305: v44.58,64.26 43.88,64.26 41.53,66.61 v41.53,67.12
N$2
  Top 0.305: R47.2 R13.1
N$4
  Top 0.305: R8.1 C3.2 R10.1
N$5
  Top 0.305: R7.2 20.83,40.01 C2.1 23.18,39.94 R9.1
N$6
  Bottom 1.016: JPHA.2 61.72,6.54 65.41,2.86 67.76,2.86 HLK1.P$1
N$7
  Top 0.305: L3.2 R50.1
N$8
  Top 0.305: L2.2 R49.1
N$10
  Top 0.305: R15.1 C7.2 R17.1
N$11
  Top 0.305: R14.2 C6.1 R16.1
N$14
  Top 0.305: R22.1 20.83,44.2 C16.2 23.18,44.26 R36.1
N$17
  Top 0.305: R24.1 C11.2 R26.1
N$18
  Top 0.305: R23.2 C10.1 R25.1
N$20
  Top 0.305: R56.1 66.04,46.48 68.45,46.48 68.58,46.35 CF3.A
N$21
  Top 0.508: R58.1 ON/OFF.A
N$22
  Top 0.305: IRQ0.A 67.02,38.76 67.25,38.99 67.25,41.15 67.56,41.46 R54.1
N$23
  Top 0.305: IRQ1.A 72.68,38.99 73.47,38.99 73.85,39.37 73.85,41.15 74.17,41.46 R55.1
N$29
  Top 0.305: R53.1 72.77,46.42 74.99,46.42 75.25,46.16 CF4.A
N$32
  Top 0.305: R49.2 R30.1
N$33
  Top 0.305: R30.2 R31.1
N$35
  Top 0.305: L1.2 R47.1
N$36
  Top 0.305: R13.2 R18.1
N$41
  Top 0.305: R21.2 20.83,51.56 C15.1 23.18,51.5 R35.1
N$45
  Top 0.305: R50.2 R38.1
N$46
  Top 0.305: R38.2 R39.1
PHA
  Top 0.305: L1.1 38.16,8.76 36.82,7.42 X1.4
  Bottom 1.016: JPHA.1 57.47,2.67 56.33,1.52 38.16,1.52 36.82,2.87 X1.4
PHB
  Top 0.305: L2.1 43.88,10.93 43.88,9.46 41.82,7.4 X1.3
PHC
  Top 0.305: L3.1 49.34,9.97 46.8,7.43 46.82,7.41 X1.2
PM1_ADE
  Top 0.305: U1.5 45.39,52.33 43.44,54.29 R59.2 43.43,56.77 45.13,58.47 X4.12
REF
  Top 0.305: C45.2 C41.2 38.86,45.72 39.94,46.8 42.15,46.8 U1.16
RESET
  Top 0.305: C18.1 85.41,46.08 SW2.B' SW2.B 85.43,40.03 R1.1 | C18.1 83.44,47.94 81.92,49.47 81.92,69.09 81.09,69.91 80.35,69.91 X4.3 | SV2.6 90.42,47.69 88.71,49.4 85.98,49.4 85.41,48.83 C18.1
RESET_ADE
  Top 0.305: X4.11 43.99,59.74 41.59,57.34 R2.1 C1.1 40.07,53.91 40.7,53.28 43.56,53.28 44.89,51.94 U1.6
RX0  (via drill 0.35)
  Top 0.305: v92.84,57.91 95.44,57.91 95.89,58.36 v95.89,61.15 | v95.89,67.31 95.93,67.36 X4.34
  Bottom 0.305: SV2.4 94.04,42.61 92.84,43.81 v92.84,57.91 | v95.89,61.15 v95.89,67.31
SCL  (via drill 0.35)
  Top 0.305: v92.46,69.91 97.32,69.91 X4.36 | SV1.5 75.69,74.3 74.04,72.64 52.39,72.64 51.24,71.5 R32.2 49.62,70.57 49.4,70.36 47.88,70.36 47.47,69.95 U2.8
  Bottom 0.305: v92.46,69.91 92.46,70.93 91.25,72.14 77.03,72.14 75.69,73.47 SV1.5
SCLK_ADE  (via drill 0.35)
  Top 0.305: v93.79,62.29 97.32,62.29 X4.30 | v76.2,55.44 65.98,55.44 59.88,49.34 v55.18,49.34 55.18,48.83 54.12,47.77 U1.37 | R45.1 28.61,70.1 | 28.61,70.1 29.65,70.1 36.83,62.93 v36.83,60.07 | USD.5 25.18,68.99 25.34,68.83 28.26,68.83 28.61,69.18 28.61,70.1
  Bottom 0.305: v76.2,55.44 83.06,62.29 v93.79,62.29 | v36.83,60.07 52.01,60.07 55.18,56.9 v55.18,49.34
SDA  (via drill 0.35)
  Top 0.305: v93.34,66.1 97.32,66.1 X4.33 | SV1.4 73.15,74.36 72.9,74.11 44.7,74.11 43.66,73.06 R34.2 43.66,70.7 44.13,70.23 45.59,70.23 45.87,69.96 U2.1
  Bottom 0.305: v93.34,66.1 89.15,70.29 74.23,70.29 73.15,71.37 SV1.4
SS_ADE
  Top 0.305: X4.13 80.32,57.21 58.23,57.21 56.33,55.31 R57.1 54.16,54.29 49.15,49.28 48.64,49.28 48.64,49.27 U1.40
TX0  (via drill 0.35)
  Top 0.305: v94.87,68.52 97.23,68.52 X4.35
  Bottom 0.305: SV2.5 94.74,45.15 94.3,45.59 94.3,60.77 94.87,61.34 v94.87,68.52
VAN
  Top 0.305: C52.1 R33.1 C27.1 35.03,34.33 40.83,40.13 40.83,44.96 41.15,45.27 U1.19
VAP
  Top 0.305: R18.2 R29.2 C23.1 38.16,24.57 | 38.16,24.57 38.16,35.81 42.17,39.82 U1.20 | C52.2 38.15,24.56 38.16,24.57
VBN
  Top 0.305: C54.1 R43.1 C35.1 40.42,36.62 42.93,39.12 42.93,44.02 U1.21
VBP
  Top 0.305: R31.2 R37.2 C33.1 43.81,24.19 43.81,24.51 | C54.2 43.76,24.56 43.81,24.51 | U1.22 43.39,29.95 43.81,29.53 43.81,26.61 43.81,26.6 43.81,24.51
VCN
  Top 0.305: C55.1 R44.1 C36.1 45.63,30.5 43.89,32.24 U1.23
VCP
  Top 0.305: R39.2 R42.2 C34.1 49.34,24.57 | 49.34,24.57 49.34,27.24 49.34,29.53 44.39,34.47 U1.24 | C55.2 49.33,24.56 49.34,24.57

### Text on the board
tNames: SMART METER 1.0 | 5V | GND | 3V3 | SDA | SCL | R34 | CTA | I/O | RST | TX | RX | CTB | 3V3 | CTS | GND | CTC | CTN | VCC | PHA | N